# Altium schematic sheet schel.SchDoc
size A3
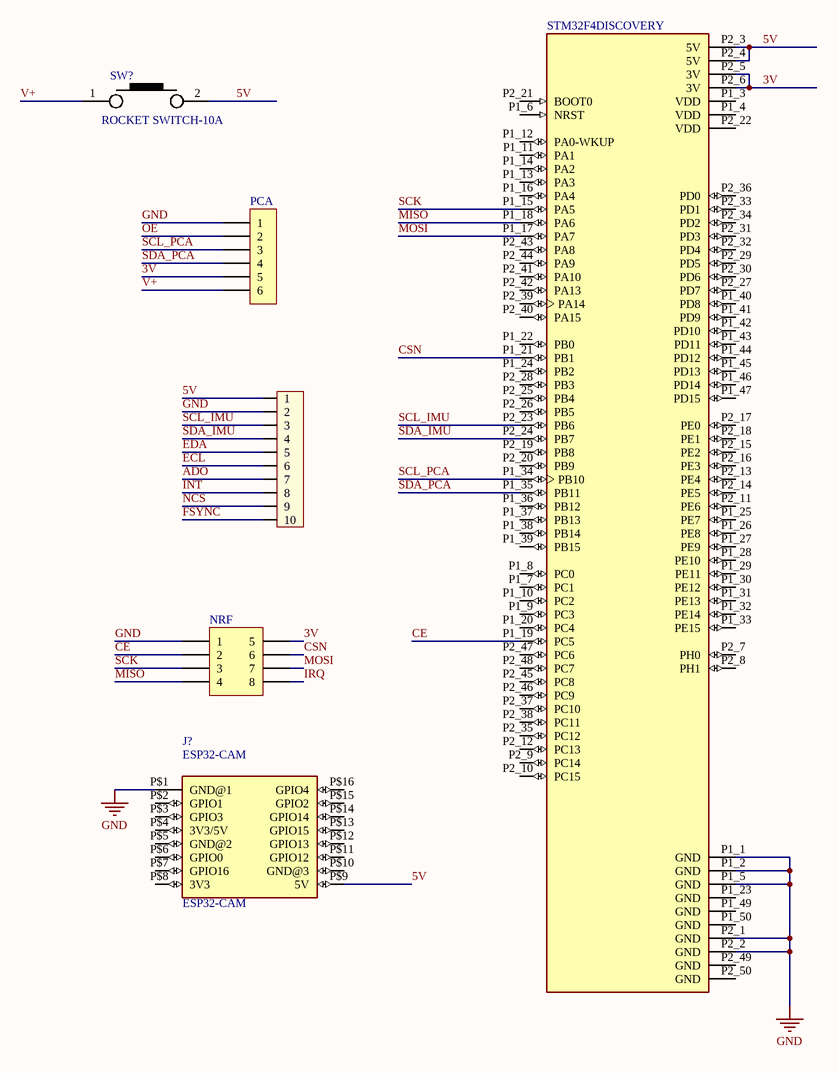
[diagram p0: schel.SchDoc]

## Parts
IMU  (no value)  [Header 10P DC 2.54]
J?  ESP32-CAM  [ESP32-CAM]
NRF  (no value)  [HDR2X4_CEN]
PCA  (no value)  [XH2.54M-6]
STM32F4DISCOVERY  (no value)  [MODULE_STM32F4DISCOVERY]
SW?  ROCKET SWITCH-10A  [SW_2ARS_TH]

## Nets
GND: IMU.2 J?.P$1(GND@1) NRF.1 PCA.1 STM32F4DISCOVERY.P1_1(GND) STM32F4DISCOVERY.P1_2(GND) STM32F4DISCOVERY.P1_5(GND) STM32F4DISCOVERY.P2_1(GND) STM32F4DISCOVERY.P2_2(GND)
3V: NRF.5 PCA.5 STM32F4DISCOVERY.P2_5(3V) STM32F4DISCOVERY.P2_6(3V)
5V: IMU.1 J?.P$9(5V) STM32F4DISCOVERY.P2_3(5V) STM32F4DISCOVERY.P2_4(5V) SW?.2
ADO: IMU.7
CE: NRF.2 STM32F4DISCOVERY.P1_19(PC5)
CSN: NRF.6 STM32F4DISCOVERY.P1_21(PB1)
ECL: IMU.6
EDA: IMU.5
FSYNC: IMU.10
INT: IMU.8
IRQ: NRF.8
MISO: NRF.4 STM32F4DISCOVERY.P1_18(PA6)
MOSI: NRF.7 STM32F4DISCOVERY.P1_17(PA7)
NCS: IMU.9
OE: PCA.2
SCK: NRF.3 STM32F4DISCOVERY.P1_15(PA5)
SCL_IMU: IMU.3 STM32F4DISCOVERY.P2_23(PB6)
SCL_PCA: PCA.3 STM32F4DISCOVERY.P1_34(PB10)
SDA_IMU: IMU.4 STM32F4DISCOVERY.P2_24(PB7)
SDA_PCA: PCA.4 STM32F4DISCOVERY.P1_35(PB11)
V+: PCA.6 SW?.1

Not connected (* = marked no-connect by the designer): J? P$2(GPIO1) P$3(GPIO3) P$4(3V3/5V) P$5(GND@2) P$6(GPIO0) P$7(GPIO16) P$8(3V3) P$10(GND@3) P$11(GPIO12) P$12(GPIO13) P$13(GPIO15) P$14(GPIO14) P$15(GPIO2) P$16(GPIO4); STM32F4DISCOVERY P1_3(VDD) P1_4(VDD) P1_6(NRST) P1_7(PC1) P1_8(PC0) P1_9(PC3) P1_10(PC2) P1_11(PA1) P1_12(PA0-WKUP) P1_13(PA3) P1_14(PA2) P1_16(PA4) P1_20(PC4) P1_22(PB0) P1_23(GND) P1_24(PB2) P1_25(PE7) P1_26(PE8) P1_27(PE9) P1_28(PE10) P1_29(PE11) P1_30(PE12) P1_31(PE13) P1_32(PE14) P1_33(PE15) P1_36(PB12) P1_37(PB13) P1_38(PB14) P1_39(PB15) P1_40(PD8) P1_41(PD9) P1_42(PD10) P1_43(PD11) P1_44(PD12) P1_45(PD13) P1_46(PD14) P1_47(PD15) P1_49(GND) P1_50(GND) P2_7(PH0) P2_8(PH1) P2_9(PC14) P2_10(PC15) P2_11(PE6) P2_12(PC13) P2_13(PE4) P2_14(PE5) P2_15(PE2) P2_16(PE3) P2_17(PE0) P2_18(PE1) P2_19(PB8) P2_20(PB9) P2_21(BOOT0) P2_22(VDD) P2_25(PB4) P2_26(PB5) P2_27(PD7) P2_28(PB3) P2_29(PD5) P2_30(PD6) P2_31(PD3) P2_32(PD4) P2_33(PD1) P2_34(PD2) P2_35(PC12) P2_36(PD0) P2_37(PC10) P2_38(PC11) P2_39(PA14) P2_40(PA15) P2_41(PA10) P2_42(PA13) P2_43(PA8) P2_44(PA9) P2_45(PC8) P2_46(PC9) P2_47(PC6) P2_48(PC7) P2_49(GND) P2_50(GND)

## Library data of the parts
IMU = Header 10P 2.54 Duc Cong: Cắm; Ten_Linh_Kien: Header 10P XH2.54-10P Đực Cong; Don_Vi: Con; Ma_Hang: MH007094; Chung_Loai: Cắm
J? = ESP32-CAM: ESP32 ESP32 Transceiver; 802.11 a/b/g/n (Wi-Fi, WiFi, WLAN), BluetoothÂ® Smart 4.x Low Energy (BLE) Evaluation Board; MF: AI-Thinker; SnapEDA_Link: https://www.snapeda.com/parts/ESP32-CAM/AI-Thinker/view-part/?ref=snap; Package: None; Value: *; MP: ESP32-CAM; Check_prices: https://www.snapeda.com/parts/ESP32-CAM/AI-Thinker/view-part/?ref=eda
NRF = Header 4X2A: Header, 4-Pin, Dual row; LatestRevisionDate: 17-Jul-2002; LatestRevisionNote: Re-released for DXP Platform.; Publisher: Altium Limited
PCA = Header 6P 2.54 Duc Thang: Cắm; Ten_Linh_Kien: Header 6P XH2.54-6P Đực Thẳng; Don_Vi: Con; Ma_Hang: MH001972; Chung_Loai: Cắm
STM32F4DISCOVERY = STM32F4DISCOVERY: Development kit: ARM ST; pin strips, pin header; No.of; Availability: Unavailable; MP: STM32F4DISCOVERY; Value: *; Price: None; Package: None
SW? = SW1_10A-SRB23A2BBBNN-TH: Rocker Switch SPDT 10A (AC) 125V Panel Mount, Snap-In; Manufacturer: ITT C&K; Alternate Part Number-1: NA; Manufacturer Part Number: SRB23A2BBBNN; Case/Package: TH; Supplier-1: SP ROAD; Supplier Part Number-1: SRB23A2BBBNN